# EasyEDA Pro project ProPrj_Business-Card.epro

# Schematic Schematic1
Board Name: Board1; Create Date: 2024-12-02; Page Name: P1; Project Name: Business-Card; Schematic Name: Schematic1; Update Date: 2024-12-02; Company: EasyEDA.com; Drawn: annoyedmilk; Page Size: A4; Part Number: JLCPCB-001; Reviewed: EasyEDA; Version: V1.2
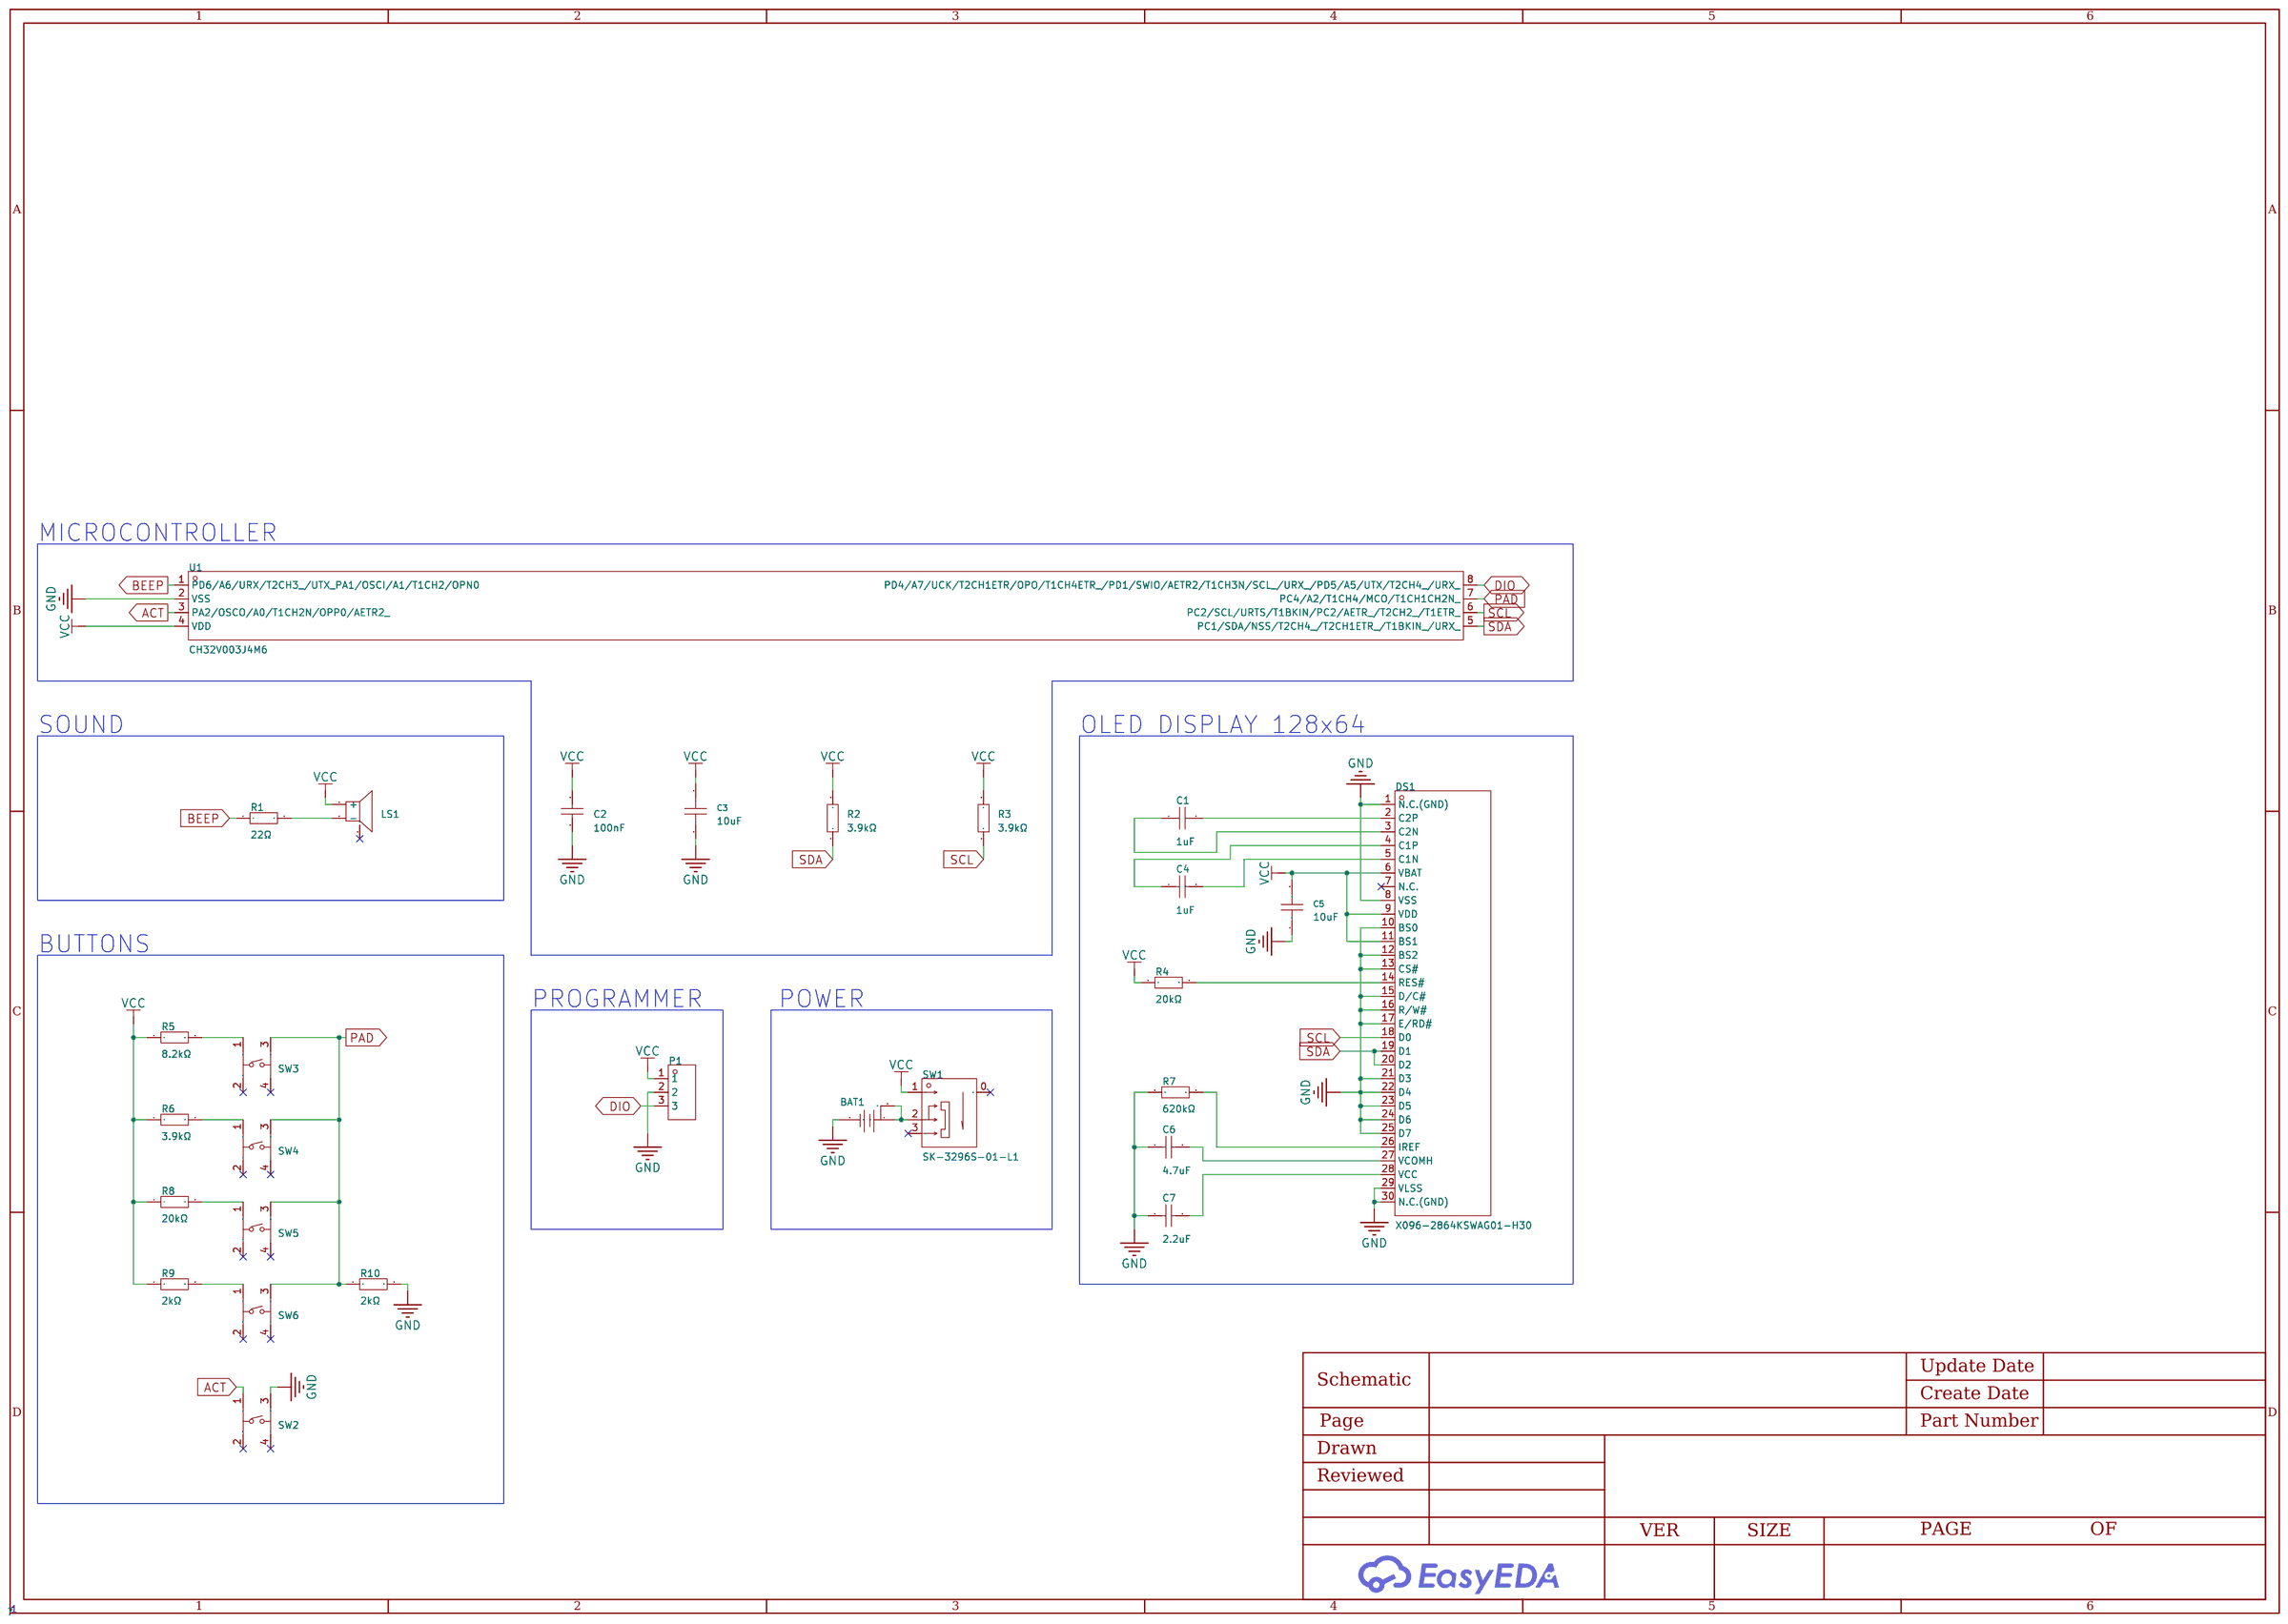
[diagram p0: schematic sheet]

## Parts
BAT1  3034TR  [BAT-SMD_3034TR]
C1  1uF  [C0805]
C2  100nF  [C0805]
C3  10uF  [C0805]
C4  1uF  [C0805]
C5  10uF  [C0805]
C6  4.7uF  [C0805]
C7  2.2uF  [C0805]
DS1  X096-2864KSWAG01-H30  [LCD-SMD_X096-2864KSWAG01-H30]
LS1  4kHz  [BUZ-SMD_3P-L5.2-W5.2-P3.50-BR]
P1  X6511FRS-03-C85D30  [HDR-SMD_3P-P2.54-H-F-L11.5]
R1  22Ω  [R0805]
R2  3.9kΩ  [R0805]
R3  3.9kΩ  [R0805]
R4  20kΩ  [R0805]
R5  8.2kΩ  [R0805]
R6  3.9kΩ  [R0805]
R7  620kΩ  [R0805]
R8  20kΩ  [R0805]
R9  2kΩ  [R0805]
R10  2kΩ  [R0805]
SW1  SK-3296S-01-L1  [SW-SMD_3P-P1.50_L2.7-W6.6]
SW2  TS110926045  [SW-SMD_4P-L4.5-W4.5-P3.00-LS6.6]
SW3  TS110926045  [SW-SMD_4P-L4.5-W4.5-P3.00-LS6.6]
SW4  TS110926045  [SW-SMD_4P-L4.5-W4.5-P3.00-LS6.6]
SW5  TS110926045  [SW-SMD_4P-L4.5-W4.5-P3.00-LS6.6]
SW6  TS110926045  [SW-SMD_4P-L4.5-W4.5-P3.00-LS6.6]
U1  CH32V003J4M6  [SOP-8_L4.9-W3.8-P1.27-LS6.0-BL]

## Library data of the parts
BAT1 = 3034TR: Supplier Part: C5213768; Manufacturer: Keystone; JLCPCB Part Class: Extended Part; Datasheet: https://atta.szlcsc.com/upload/public/pdf/source/20230320/A985455E717BDA8799420FB33BE36BF6.pdf; Supplier: LCSC
C1 C4 = GRM21BR71E105KA99L: Capacitance: Tolerance:±10% Tolerance:±10% Voltage Rated: Temperature Coefficient:; LCSC Part Name: 1uF ±10% 25V; Supplier Part: C77080; Manufacturer: muRata(村田); Supplier Footprint: 0805; JLCPCB Part Class: Extended Part; Datasheet: https://atta.szlcsc.com/upload/public/pdf/source/20200305/C490387_23319AE8C154DEB24C505E6C82A8106A.pdf; Supplier: LCSC; Tolerance: ±10%
C2 = CC0805KRX7R9BB104: Capacitance: Tolerance:±10% Tolerance:±10% Voltage Rated: Temperature Coefficient:; LCSC Part Name: 100nF ±10% 50V; Supplier Part: C49678; Manufacturer: YAGEO(国巨); Supplier Footprint: 0805; JLCPCB Part Class: Basic Part; Datasheet: https://atta.szlcsc.com/upload/public/pdf/source/20180224/C181747_15194369449651363981.pdf; Supplier: LCSC; Tolerance: ±10%
C3 C5 = GRM21BR61C106KE15L: Capacitance: Tolerance:±10% Tolerance:±10% Voltage Rated: Temperature Coefficient:; LCSC Part Name: 10uF ±10% 16V; Supplier Part: C77075; Manufacturer: muRata(村田); Supplier Footprint: 0805; JLCPCB Part Class: Extended Part; Datasheet: https://atta.szlcsc.com/upload/public/pdf/source/20200305/C490387_23319AE8C154DEB24C505E6C82A8106A.pdf; Supplier: LCSC; Tolerance: ±10%
C6 = GRM21BR61E475KA12L: Capacitance: Tolerance:±10% Tolerance:±10% Voltage Rated: Temperature Coefficient:; LCSC Part Name: 4.7uF ±10% 25V; Supplier Part: C77077; Manufacturer: muRata(村田); Supplier Footprint: 0805; JLCPCB Part Class: Extended Part; Datasheet: https://atta.szlcsc.com/upload/public/pdf/source/20200305/C490387_23319AE8C154DEB24C505E6C82A8106A.pdf; Supplier: LCSC; Tolerance: ±10%
C7 = GRM21BR71E225KE11L: Capacitance: Tolerance:±10% Tolerance:±10% Voltage Rated: Temperature Coefficient:; LCSC Part Name: 2.2uF ±10% 25V; Supplier Part: C77081; Manufacturer: muRata(村田); Supplier Footprint: 0805; JLCPCB Part Class: Extended Part; Datasheet: https://atta.szlcsc.com/upload/public/pdf/source/20200305/C490387_23319AE8C154DEB24C505E6C82A8106A.pdf; Supplier: LCSC; Tolerance: ±10%
DS1 = X096-2864KSWAG01-H30: Main Control Chip:SSD1315 Size:0.96 Pixel Resolution:128x64; LCSC Part Name: 0.96寸 白光 128x64像素分辨率 30PIN; Supplier Part: C5123563; Manufacturer: Newvision(新智景); JLCPCB Part Class: Extended Part; Datasheet: https://atta.szlcsc.com/upload/public/pdf/source/20220805/0CBF3995E81D02B55D6A971F6BD83BE7.pdf; Supplier: LCSC; Main Control Chip: SSD1315; Size: 0.96; Pixel Resolution: 128x64
LS1 = MLT-5030: Oscillator Circuit:无源(外部驱动) Technology Type:电磁式 Frequency:4kHz Length:5.2mm Width:5.2mm Height:3.4mm; Supplier Part: C95297; Manufacturer: 华能; Supplier Footprint: SMD,5.2x5.7mm; JLCPCB Part Class: Extended Part; Datasheet: https://atta.szlcsc.com/upload/public/pdf/source/20210811/34F4796C2E46AFF95CD06C7B863D8CCF.pdf; Supplier: LCSC; Oscillator Circuit: 无源(外部驱动); Technology Type: 电磁式; Length: 5.2mm; Width: 5.2mm; Height: 3.4mm
P1 = X6511FRS-03-C85D30: Holes Structure:1x3P Pitch:2.54mm Mounting Type:卧贴 Number of Rows:Plugin Number of Holes:3P Insulation Height:8.5mm; LCSC Part Name: 间距:2.54mm 1x3P 卧贴; Supplier Part: C5142236; Manufacturer: XKB Connectivity(中国星坤); Supplier Footprint: SMD,P=2.54mm,卧贴; JLCPCB Part Class: Extended Part; Datasheet: https://atta.szlcsc.com/upload/public/pdf/source/20220822/AB9A82E80C220285963E5EFA3BFD32FF.pdf; Supplier: LCSC; Holes Structure: 1x3P; Pitch: 2.54mm; Mounting Type: 卧贴; Number of Rows: Plugin; Number of Holes: 3P; Insulation Height: 8.5mm
R1 = RC0805FR-0722RL: Type:Thick Film Resistors Resistance: Tolerance:±1% Tolerance:±1% Power(Watts): Overload Voltage (Max): Temperature Coefficient:±100ppm/℃ Temperature Coefficient:±100ppm/℃ Operating Temperature Range:-55℃~+155℃ Operating Temperature Range:-55℃~+155℃; LCSC Part Name: 厚膜电阻 22Ω ±1% 125mW; Supplier Part: C107702; Manufacturer: YAGEO(国巨); Supplier Footprint: 0805; JLCPCB Part Class: Extended Part; Datasheet: https://atta.szlcsc.com/upload/public/pdf/source/20180821/C275644_0D56F95EFF785E7D9A1FEF436B37DA78.pdf; Supplier: LCSC; Type: Thick Film Resistors; Tolerance: ±1%; Temperature Coefficient: ±100ppm/℃; Operating Temperature Range: -55℃~+155℃
R2 R3 R6 = RC0805FR-073K9L: Type:Thick Film Resistors Resistance: Tolerance:±1% Tolerance:±1% Power(Watts): Overload Voltage (Max): Temperature Coefficient:±100ppm/℃ Temperature Coefficient:±100ppm/℃ Operating Temperature Range:-55℃~+155℃ Operating Temperature Range:-55℃~+155℃; LCSC Part Name: 厚膜电阻 3.9kΩ ±1% 125mW; Supplier Part: C114221; Manufacturer: YAGEO(国巨); Supplier Footprint: 0805; JLCPCB Part Class: Extended Part; Datasheet: https://atta.szlcsc.com/upload/public/pdf/source/20170705/1499242700908.pdf; Supplier: LCSC; Type: Thick Film Resistors; Tolerance: ±1%; Temperature Coefficient: ±100ppm/℃; Operating Temperature Range: -55℃~+155℃
R4 R8 = RC0805FR-0720KL: Type:Thick Film Resistors Resistance: Tolerance:±1% Tolerance:±1% Power(Watts): Overload Voltage (Max): Temperature Coefficient:±100ppm/℃ Temperature Coefficient:±100ppm/℃ Operating Temperature Range:-55℃~+155℃ Operating Temperature Range:-55℃~+155℃; LCSC Part Name: 厚膜电阻 20kΩ ±1% 125mW; Supplier Part: C114566; Manufacturer: YAGEO(国巨); Supplier Footprint: 0805; JLCPCB Part Class: Extended Part; Datasheet: https://atta.szlcsc.com/upload/public/pdf/source/20180821/C275644_0D56F95EFF785E7D9A1FEF436B37DA78.pdf; Supplier: LCSC; Type: Thick Film Resistors; Tolerance: ±1%; Temperature Coefficient: ±100ppm/℃; Operating Temperature Range: -55℃~+155℃
R5 = RC0805FR-078K2L: Type:Thick Film Resistors Resistance: Tolerance:±1% Tolerance:±1% Power(Watts): Overload Voltage (Max): Temperature Coefficient:±100ppm/℃ Temperature Coefficient:±100ppm/℃ Operating Temperature Range:-55℃~+155℃ Operating Temperature Range:-55℃~+155℃; LCSC Part Name: 厚膜电阻 8.2kΩ ±1% 125mW; Supplier Part: C114545; Manufacturer: YAGEO(国巨); Supplier Footprint: 0805; JLCPCB Part Class: Extended Part; Datasheet: https://atta.szlcsc.com/upload/public/pdf/source/20180821/C275644_0D56F95EFF785E7D9A1FEF436B37DA78.pdf; Supplier: LCSC; Type: Thick Film Resistors; Tolerance: ±1%; Temperature Coefficient: ±100ppm/℃; Operating Temperature Range: -55℃~+155℃
R7 = RC0805FR-07620KL: Type:Thick Film Resistors Resistance: Tolerance:±1% Tolerance:±1% Power(Watts): Overload Voltage (Max): Temperature Coefficient:±100ppm/℃ Temperature Coefficient:±100ppm/℃ Operating Temperature Range:-55℃~+155℃ Operating Temperature Range:-55℃~+155℃; LCSC Part Name: 厚膜电阻 620kΩ ±1% 125mW; Supplier Part: C185284; Manufacturer: YAGEO(国巨); Supplier Footprint: 0805; JLCPCB Part Class: Extended Part; Datasheet: https://atta.szlcsc.com/upload/public/pdf/source/20180904/C276339_014E484F1DBA106FB92D45EABD5A1AC1.pdf; Supplier: LCSC; Type: Thick Film Resistors; Tolerance: ±1%; Temperature Coefficient: ±100ppm/℃; Operating Temperature Range: -55℃~+155℃
R9 R10 = RC0805FR-072KL: Type:Thick Film Resistors Resistance: Tolerance:±1% Tolerance:±1% Power(Watts): Overload Voltage (Max): Temperature Coefficient:±100ppm/℃ Temperature Coefficient:±100ppm/℃ Operating Temperature Range:-55℃~+155℃ Operating Temperature Range:-55℃~+155℃; LCSC Part Name: 厚膜电阻 2kΩ ±1% 125mW; Supplier Part: C114572; Manufacturer: YAGEO(国巨); Supplier Footprint: 0805; JLCPCB Part Class: Extended Part; Datasheet: https://atta.szlcsc.com/upload/public/pdf/source/20170815/C125758_1502799027253889202.pdf; Supplier: LCSC; Type: Thick Film Resistors; Tolerance: ±1%; Temperature Coefficient: ±100ppm/℃; Operating Temperature Range: -55℃~+155℃
SW1 = SK-3296S-01-L1: Circuit:SPDT Actuator Style:Rectangular columnar Pin Style:SMDSplicing Switch Length:7.8mm Switch Width:2.75mm Switch Height:1.35mm Mounting Style:卧贴 Actuator Color:Black Current Rating (DC):50mA Voltage Rating (DC):12V Current Rating (AC):50mA Voltage Ra; LCSC Part Name: 柄长1.5mm 卧贴双档 滑动开关; Supplier Part: C319020; Manufacturer: XKB Connectivity(中国星坤); Supplier Footprint: SMD; JLCPCB Part Class: Extended Part; Datasheet: https://atta.szlcsc.com/upload/public/pdf/source/20211011/33977E7F5E3AE40A3E3DC6795807E20F.pdf; Supplier: LCSC; Circuit: SPDT; Actuator Style: Rectangular columnar; Pin Style: SMDSplicing; Switch Length: 7.8mm; Switch Width: 2.75mm; Switch Height: 1.35mm; Mounting Style: 卧贴; Actuator Color: Black; Current Rating (DC): 50mA; Voltage Rating (DC): 12V; Current Rating (AC): 50mA; Voltage Rating (AC): 12V; Mechanical Life: 1万次; Operating Temperature: -40℃~+85℃
SW2-SW6 = TS110926045: Supplier Part: C22375351; Manufacturer: HanElectricity(瀚源); Supplier Footprint: SMD-4P,4.5x4.5mm; JLCPCB Part Class: Extended Part; Datasheet: https://atta.szlcsc.com/upload/public/pdf/source/20240426/95AB8AE9F5C7D8E59EA33F5636E95D0F.pdf; Supplier: LCSC
U1 = CH32V003J4M6_C5346354: Supplier Part: C5346354; Manufacturer: WCH(南京沁恒); Supplier Footprint: SOP-8; JLCPCB Part Class: Extended Part; Datasheet: https://atta.szlcsc.com/upload/public/pdf/source/20240313/8FAFD0DE100342130E64AE37B01CD8FD.pdf; Supplier: LCSC

## Nets
GND: BAT1.2 C2.1 C3.1 C5.1 C6.1 C7.1 DS1.1(N.C.(GND)) DS1.8(VSS) DS1.10(BS0) DS1.12(BS2) DS1.13(CS#) DS1.15(D/C#) DS1.16(R/W#) DS1.17(E/RD#) DS1.21(D3) DS1.22(D4) DS1.23(D5) DS1.24(D6) DS1.25(D7) DS1.29(VLSS) DS1.30(N.C.(GND)) P1.2 R7.1 R10.2 SW2.3 U1.2(VSS)
VCC: C2.2 C3.2 C5.2 DS1.6(VBAT) DS1.9(VDD) DS1.11(BS1) LS1.2(+) P1.1 R2.2 R3.2 R4.1 R5.1 R6.1 R8.1 R9.1 SW1.1 U1.4(VDD)
ACT: SW2.1 U1.3(PA2/OSCO/A0/T1CH2N/OPP0/AETR2_)
BEEP: R1.1 U1.1(PD6/A6/URX/T2CH3_/UTX_PA1/OSCI/A1/T1CH2/OPN0)
DIO: P1.3 U1.8(PD4/A7/UCK/T2CH1ETR/OPO/T1CH4ETR_/PD1/SWIO/AETR2/T1CH3N/SCL_/URX_/PD5/A5/UTX/T2CH4_/URX_)
PAD: R10.1 SW3.3 SW4.3 SW5.3 SW6.3 U1.7(PC4/A2/T1CH4/MCO/T1CH1CH2N_)
SCL: DS1.18(D0) R3.1 U1.6(PC2/SCL/URTS/T1BKIN/PC2/AETR_/T2CH2_/T1ETR_)
SDA: DS1.19(D1) DS1.20(D2) R2.1 U1.5(PC1/SDA/NSS/T2CH4_/T2CH1ETR_/T1BKIN_/URX_)
$1N3406: R5.2 SW3.1
$1N3419: R6.2 SW4.1
$1N3469: R8.2 SW5.1
$1N3474: R9.2 SW6.1
$1N4825: C1.2 DS1.2(C2P)
$1N4829: C1.1 DS1.3(C2N)
$1N4838: C4.1 DS1.4(C1P)
$1N4846: C4.2 DS1.5(C1N)
$1N5181: DS1.26(IREF) R7.2
$1N5188: C6.2 DS1.27(VCOMH)
$1N5195: C7.2 DS1.28(VCC)
$1N9610: LS1.3(-) R1.2
$1N12611: DS1.14(RES#) R4.2
$1N14627: BAT1.1 BAT1.3 SW1.2

Not connected (* = marked no-connect by the designer): DS1 7(N.C.)*; LS1 1(NC)*; SW1 0* 3*; SW2 2* 4*; SW3 2* 4*; SW4 2* 4*; SW5 2* 4*; SW6 2* 4*

## Notes on the sheet
- MICROCONTROLLER
- SOUND
- OLED DISPLAY 128x64
- BUTTONS
- PROGRAMMER
- POWER

# Board PCB1
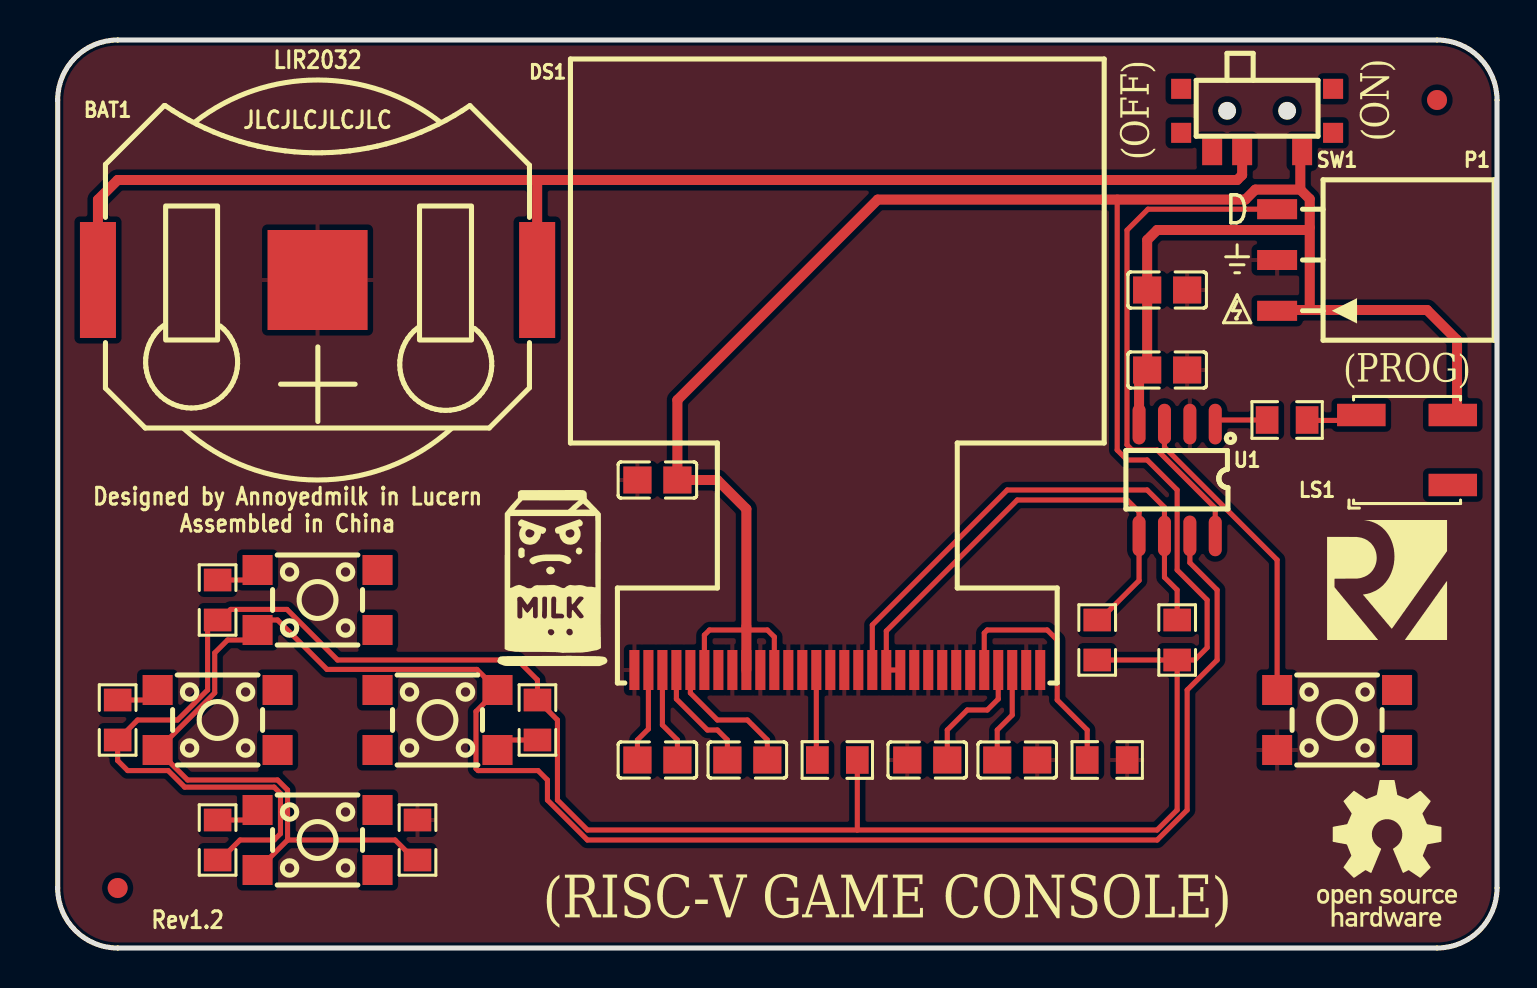
[diagram p1: board, top side]
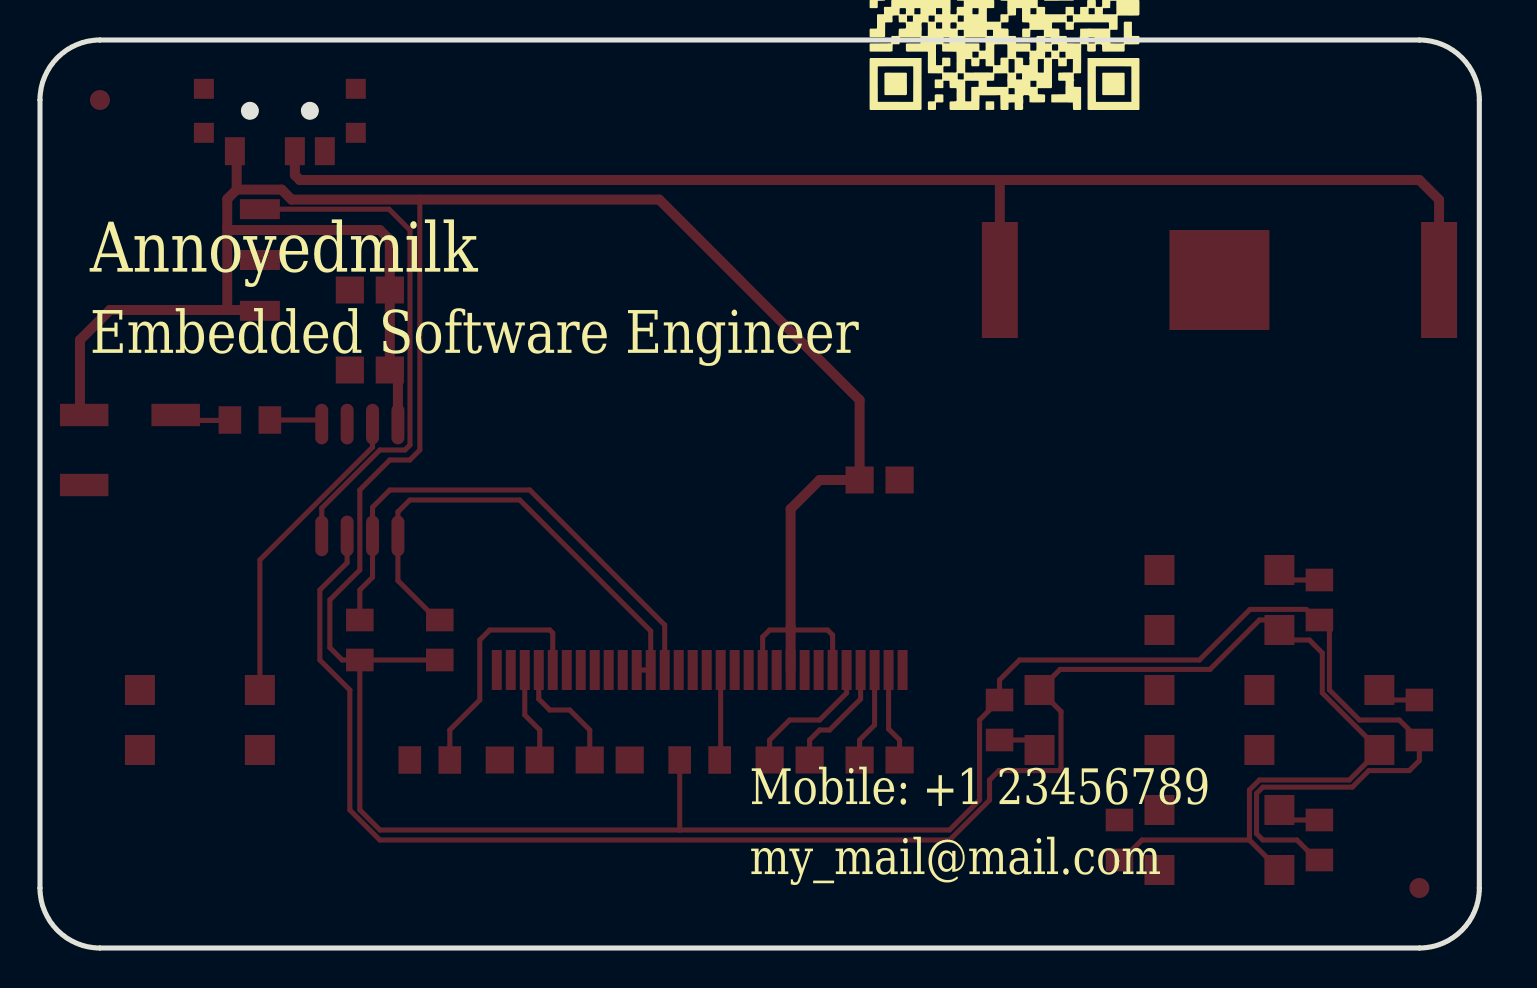
[diagram p2: board, bottom side, seen from below]

Outline 72 x 45.4 mm; copper layers: Top Layer, Bottom Layer. Coordinates in mm from the lower left corner of the outline.
Outline path: 0,42.4 0,3 arc(0.88,0.88) 3,0 69,0 arc(71.12,0.88) 72,3 72,42.4 arc(71.12,44.52) 69,45.4 3,45.4 arc(0.88,44.52) 0,42.4
Stack: Top Layer 0.035mm / Dielectric1 0.71mm FR4 er 4.5 / Bottom Layer 0.035mm

## Design rules (mm)
template: JLCPCB Capability(Two Layers Board)
spacing copperThickness1oz (default): track to track 0.102, other pairs 0.152 to 0.3
spacing copperThickness2oz: track to track 0.203, other pairs 0.152 to 0.3
track width copperThickness1oz (default): min 0.127, default 0.254, max 2.54
track width copperThickness2oz: min 0.203, default 0.254, max 2.54
differential pair differentialPair (default): width min 0.127, default 0.254, max 2.54; gap min 0.152, default 0.152
via viaSize (default): diameter min 0.5, default 0.61, max 10; hole min 0.3, default 0.305, max 6.3

## Placement (name value [footprint] x y rotation side)
BAT1  3034TR  [BAT-SMD_3034TR]  13 33.4 0 top
C1  1uF  [C0805]  30 9.4 180 top
C2  100nF  [C0805]  55.5 28.9 180 top
C3  10uF  [C0805]  55.5 32.9 180 top
C4  1uF  [C0805]  34.5 9.4 0 top
C5  10uF  [C0805]  30 23.4 0 top
C6  4.7uF  [C0805]  43.5 9.4 0 top
C7  2.2uF  [C0805]  48 9.4 180 top
DS1  X096-2864KSWAG01-H30  [LCD-SMD_X096-2864KSWAG01-H30]  39 13.9 0 top
LS1  4kHz  [BUZ-SMD_3P-L5.2-W5.2-P3.50-BR]  67.5 24.9 270 top
NOREF  -  [Pad_e958]  69 42.4 0 top
NOREF#2  -  [Pad_e957]  3 3 0 top
P1  X6511FRS-03-C85D30  [HDR-SMD_3P-P2.54-H-F-L11.5]  61 34.4 90 top
R1  22Ω  [R0805]  61.5 26.4 0 top
R2  3.9kΩ  [R0805]  52 15.4 270 top
R3  3.9kΩ  [R0805]  56 15.4 270 top
R4  20kΩ  [R0805]  39 9.4 180 top
R5  8.2kΩ  [R0805]  8 17.4 90 top
R6  3.9kΩ  [R0805]  8 5.4 90 top
R7  620kΩ  [R0805]  52.5 9.4 180 top
R8  20kΩ  [R0805]  24 11.4 270 top
R9  2kΩ  [R0805]  3 11.4 90 top
R10  2kΩ  [R0805]  18 5.4 90 top
SW1  SK-3296S-01-L1  [SW-SMD_3P-P1.50_L2.7-W6.6]  60 41.4 180 top
SW2  TS110926045  [SW-SMD_4P-L4.5-W4.5-P3.00-LS6.6]  64 11.4 0 top
SW3  TS110926045  [SW-SMD_4P-L4.5-W4.5-P3.00-LS6.6]  13 17.4 0 top
SW4  TS110926045  [SW-SMD_4P-L4.5-W4.5-P3.00-LS6.6]  13 5.4 0 top
SW5  TS110926045  [SW-SMD_4P-L4.5-W4.5-P3.00-LS6.6]  19 11.4 180 top
SW6  TS110926045  [SW-SMD_4P-L4.5-W4.5-P3.00-LS6.6]  8 11.4 0 top
U1  CH32V003J4M6  [SOP-8_L4.9-W3.8-P1.27-LS6.0-BL]  56 23.4 180 top

## Footprints (pads in the part's own frame, mm; a bottom-side part is the same pattern mirrored in y, then rotated)
BAT-SMD_3034TR
  rect 1.8x5.8 smd: 1(-10.985,0) 3(10.985,0)
  rect 5x5 smd: 2(0,0)
BUZ-SMD_3P-L5.2-W5.2-P3.50-BR
  rect 1.12x2.425 smd: 1(1.75,2.288) 2(-1.75,2.288) 3(-1.75,-2.288)
C0805
  rect 1.41x1.35 smd: 1(-1,0) 2(1,0)
HDR-SMD_3P-P2.54-H-F-L11.5
  rect 1x2 smd: 1(-2.54,0) 2(0,0) 3(2.54,0)
LCD-SMD_X096-2864KSWAG01-H30
  rect 0.5x2 smd: 1(-10.15,0) 2(-9.45,0) 3(-8.75,0) 4(-8.05,0) 5(-7.35,0) 6(-6.65,0) 7(-5.95,0) 8(-5.25,0) 9(-4.55,0) 10(-3.85,0) 11(-3.15,0) 12(-2.45,0) 13(-1.75,0) 14(-1.05,0) 15(-0.35,0) 16(0.35,0) 17(1.05,0) 18(1.75,0) 19(2.45,0) 20(3.15,0) 21(3.85,0) 22(4.55,0) 23(5.25,0) 24(5.95,0) 25(6.65,0) 26(7.35,0) 27(8.05,0) 28(8.75,0) 29(9.45,0) 30(10.15,0)
Pad_e957
  round 1 smd: FIDUCIAL(0,0)
Pad_e958
  round 1 smd: FIDUCIAL(0,0)
R0805
  rect 1.133x1.377 smd: 1(-1,0) 2(1,0)
SOP-8_L4.9-W3.8-P1.27-LS6.0-BL
  oval 0.65x2.032 smd: 1(-1.905,-2.796) 2(-0.635,-2.796) 3(0.635,-2.796) 4(1.905,-2.796) 5(1.905,2.796) 6(0.635,2.796) 7(-0.635,2.796) 8(-1.905,2.796)
SW-SMD_3P-P1.50_L2.7-W6.6
  rect 1x1 smd: 0(-3.8,0.641) 0(-3.8,-1.559) 0(3.8,0.641) 0(3.8,-1.559)
  rect 1x1.4 smd: 1(-2.25,1.559) 2(0.75,1.559) 3(2.25,1.559)
SW-SMD_4P-L4.5-W4.5-P3.00-LS6.6
  rect 1.5x1.5 smd: 1(-3,1.5) 2(3,1.5) 3(-3,-1.5) 4(3,-1.5)

## Nets
As in the schematic.

Pads without a net: DS1 7; LS1 1; NOREF FIDUCIAL; NOREF#2 FIDUCIAL; SW1 0 3; SW2 2 4; SW3 2 4; SW4 2 4; SW5 2 4; SW6 2 4

## Routing (per net, layer and track width the routed paths; a pad name or vN(x,y) marks a point on that pad's centre or on a via; arc(x,y) is an arc through that point)
VCC: length 221.2
  Top Layer w0.254: R4.1 40,5.9 ; 40,5.9 26.5,5.9 25,7.4 25,11.4 R8.1 24,13.4 23,14.4 14,14.4 11.47,16.93 8.65,16.93 8.06,16.34 R5.1 7.5,15.9 7.5,12.9 6,11.4 4,11.4 R9.1 3,9.37 3.5,8.87 5.53,8.87 6.35,8.04 10.83,8.04 11.14,7.73 11.14,5.72 10.83,5.4 9.12,5.4 8.12,4.4 R6.1 ; 40,5.9 55,5.9 56,6.9 R3.2 ; 53,37.42 53,24.9 53.5,24.4 54.5,24.4 56,22.9 56,18.9 57.5,17.4 57.5,15.02 56.88,14.4 R3.2 ; DS1.6 32.35,15.65 32.6,15.9 34.25,15.9 34.43,16.08 ; R3.2 R2.2 ; 34.43,16.08 34.45,16.06 ; 34.43,16.08 34.45,16.08 34.63,15.9 35.5,15.9 35.85,15.55 DS1.11
  Top Layer w0.5: 34.45,16.06 DS1.9 ; 62.63,36.03 62.5,35.9 55,35.9 54.5,35.4 C3.2 C2.2 54.09,28.5 U1.4 ; 62.63,36.03 62.63,31.9 ; 62.63,36.03 62.63,37.45 62.16,37.92 ; 62.63,31.9 68.5,31.9 70,30.4 70,26.67 70.29,26.38 ; 62.63,31.9 61.04,31.9 P1.1 ; SW1.1 62.16,39.75 62.16,37.92 ; 34.45,16.08 34.45,21.95 33,23.4 C5.2 31,27.4 41.02,37.42 59.41,37.42 59.91,37.92 62.16,37.92
ACT: length 15.6
  Top Layer w0.254: SW2.1 61,19.4 55.37,25.04 U1.3
BEEP: length 2.7
  Top Layer w0.254: R1.1 58.11,26.4 U1.1
DIO: length 25.8
  Top Layer w0.254: U1.8 57.91,22 55,24.9 53.75,24.9 53.49,25.15 53.49,35.89 54.54,36.94 P1.3
PAD: length 98.7
  Top Layer w0.254: 11.5,5.4 11.5,7.9 11,8.4 6.5,8.4 SW6.3 7.86,12.76 7.86,14.76 8.5,15.4 9.5,15.4 SW3.3 10.5,16.4 11,16.4 13.47,13.93 20.97,13.93 SW5.3 20.93,11.83 20.93,8.97 21.03,8.87 24.03,8.87 24.5,8.4 24.5,7.4 26.5,5.4 55,5.4 56.5,6.9 56.5,12.9 58,14.4 58,17.9 56.63,19.27 U1.7 ; 11.5,5.4 SW4.3 ; 11.5,5.4 16.88,5.4 17.88,4.4 R10.1
SCL: length 26.4
  Top Layer w0.254: R3.1 56,17.9 55.37,18.54 U1.6 55.37,22.04 54.5,22.9 47.5,22.9 40.75,16.15 40.75,13.4
SDA: length 24.6
  Top Layer w0.254: R2.1 52.12,16.4 54.09,18.37 U1.5 54.09,21.81 53.5,22.4 48,22.4 41.45,15.85 DS1.19 DS1.20
$1N3406: length 2.5
  Top Layer w0.254: R5.2 10,18.4 SW3.1
$1N3419: length 2.2
  Top Layer w0.254: R6.2 9.5,6.4 SW4.1
$1N3469: length 2.2
  Top Layer w0.254: SW5.1 22.5,10.4 R8.2
$1N3474: length 2.2
  Top Layer w0.254: R9.2 4.5,12.4 SW6.1
$1N4825: length 4.7
  Top Layer w0.254: DS1.2 29.55,10.95 29,10.4 C1.2
$1N4829: length 4.8
  Top Layer w0.254: DS1.3 30.25,11.15 31,10.4 C1.1
$1N4838: length 5.8
  Top Layer w0.254: C4.1 33.5,10.4 33,10.9 32.5,10.9 30.95,12.45 DS1.4
$1N4846: length 7
  Top Layer w0.254: C4.2 35.5,10.4 34.5,11.4 33,11.4 31.65,12.75 DS1.5
$1N5181: length 12.4
  Top Layer w0.254: R7.2 51.5,10.9 50,12.4 50,15.4 49.5,15.9 46.5,15.9 46.35,15.75 DS1.26
$1N5188: length 6.1
  Top Layer w0.254: DS1.27 47.05,12.45 46.5,11.9 45.5,11.9 44.5,10.9 C6.2
$1N5195: length 4.8
  Top Layer w0.254: DS1.28 47.75,11.65 47,10.9 C7.2
$1N9610: length 3.2
  Top Layer w0.254: R1.2 62.52,26.38 65.71,26.38
$1N12611: length 4.5
  Top Layer w0.254: DS1.14 37.95,9.45 R4.2
$1N14627: length 68
  Top Layer w0.5: SW1.2 59.25,38.65 59,38.4 24.01,38.4 ; BAT1.3 23.99,38.37 24.01,38.4 ; 24.01,38.4 3,38.4 2.02,37.42 BAT1.1

## Copper pours and planes (outline as drawn; the poured copper is in the pictures)
GND on Top Layer: 0,45.4 72,45.4 72,-0.1 0,-0.1

## Text on the board
Bottom Silkscreen Layer: Mobile: +1 23456789 | my_mail@mail.com | Embedded Software Engineer | Annoyedmilk
Top Silkscreen Layer: Rev1.2 | Designed by Annoyedmilk in Lucern / Assembled in China | LIR2032 | JLCJLCJLCJLC | D | (PROG) | (OFF) | (ON) | (RISC-V GAME CONSOLE) | ⏚ | ⚡
